# Altium schematic sheet FPGAPower.SchDoc
size A
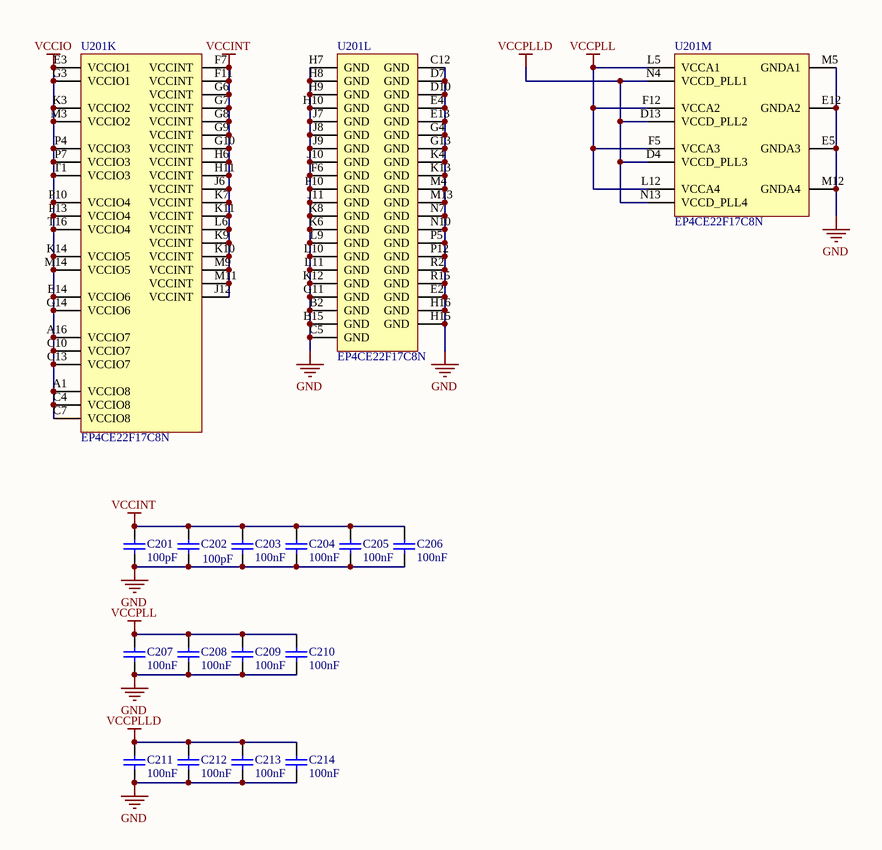
[diagram p0: FPGAPower.SchDoc]

## Parts
C201  value 100pF  [0402C]  (hidden comment: MLCC)
C202  value 100pF  [0402C]  (hidden comment: MLCC)
C203  value 100nF  [0402C]  (hidden comment: MLCC)
C204  value 100nF  [0402C]  (hidden comment: MLCC)
C205  value 100nF  [0603C]  (hidden comment: MLCC)
C206  value 100nF  [0603C]  (hidden comment: MLCC)
C207  value 100nF  [0402C]  (hidden comment: MLCC)
C208  value 100nF  [0402C]  (hidden comment: MLCC)
C209  value 100nF  [0402C]  (hidden comment: MLCC)
C210  value 100nF  [0402C]  (hidden comment: MLCC)
C211  value 100nF  [0402C]  (hidden comment: MLCC)
C212  value 100nF  [0402C]  (hidden comment: MLCC)
C213  value 100nF  [0402C]  (hidden comment: MLCC)
C214  value 100nF  [0402C]  (hidden comment: MLCC)
U201  EP4CE22F17C8N  [FBGA256_A-155]  (parts K,L,M of 13)

## Nets
GND: C201.1 C202.1 C203.1 C204.1 C205.1 C206.1 C207.1 C208.1 C209.1 C210.1 C211.1 C212.1 C213.1 C214.1 U201.B2(GND) U201.B15(GND) U201.C5(GND) U201.C12(GND) U201.D7(GND) U201.D10(GND) U201.E2(GND) U201.E4(GND) U201.E5(GNDA3) U201.E12(GNDA2) U201.E13(GND) U201.F6(GND) U201.F10(GND) U201.G4(GND) U201.G11(GND) U201.G13(GND) U201.H7(GND) U201.H8(GND) U201.H9(GND) U201.H10(GND) U201.H15(GND) U201.H16(GND) U201.J7(GND) U201.J8(GND) U201.J9(GND) U201.J10(GND) U201.J11(GND) U201.K4(GND) U201.K6(GND) U201.K8(GND) U201.K12(GND) U201.K13(GND) U201.L9(GND) U201.L10(GND) U201.L11(GND) U201.M4(GND) U201.M5(GNDA1) U201.M12(GNDA4) U201.M13(GND) U201.N7(GND) U201.N10(GND) U201.P5(GND) U201.P12(GND) U201.R2(GND) U201.R15(GND)
VCCINT: C201.2 C202.2 C203.2 C204.2 C205.2 C206.2 U201.F7(VCCINT) U201.F11(VCCINT) U201.G6(VCCINT) U201.G7(VCCINT) U201.G8(VCCINT) U201.G9(VCCINT) U201.G10(VCCINT) U201.H6(VCCINT) U201.H11(VCCINT) U201.J6(VCCINT) U201.J12(VCCINT) U201.K7(VCCINT) U201.K9(VCCINT) U201.K10(VCCINT) U201.K11(VCCINT) U201.L6(VCCINT) U201.M9(VCCINT) U201.M11(VCCINT)
VCCIO: U201.A1(VCCIO8) U201.A16(VCCIO7) U201.C4(VCCIO8) U201.C7(VCCIO8) U201.C10(VCCIO7) U201.C13(VCCIO7) U201.E3(VCCIO1) U201.E14(VCCIO6) U201.G3(VCCIO1) U201.G14(VCCIO6) U201.K3(VCCIO2) U201.K14(VCCIO5) U201.M3(VCCIO2) U201.M14(VCCIO5) U201.P4(VCCIO3) U201.P7(VCCIO3) U201.P10(VCCIO4) U201.P13(VCCIO4) U201.T1(VCCIO3) U201.T16(VCCIO4)
VCCPLL: C207.2 C208.2 C209.2 C210.2 U201.F5(VCCA3) U201.F12(VCCA2) U201.L5(VCCA1) U201.L12(VCCA4)
VCCPLLD: C211.2 C212.2 C213.2 C214.2 U201.D4(VCCD_PLL3) U201.D13(VCCD_PLL2) U201.N4(VCCD_PLL1) U201.N13(VCCD_PLL4)

## Library data of the parts
U201 = EP4CE22F17C8N: Cyclone IV Family FPGA, 1.2V Core, 153 I/O Pins, 4 PLLs, 256-Pin FBGA, Speed Grade 8, Commercial Grade, Pb-Free; Manufacturer: Altera; DatasheetVersion: ver1.6, Nov-2011; PackageVersion: ver2.0, Nov-2011; PackageReference: FBGA256_A-155; PackageDescription: 256-Pin FineLine Ball-Grid Array (FBGA) - Thin - Wire Bond - A:1.55; Code_JEDEC: MO-192-DAF-1; ComponentLink1Description: Manufacturer URL; ComponentLink1URL: http://www.altera.com/; ComponentLink2Description: Handbook; ComponentLink2URL: http://www.altera.com/literature/hb/cyclone-iv/cyclone4-handbook.pdf; ComponentLink3Description: Pinout; ComponentLink3URL: http://www.altera.com/literature/lit-dp.jsp?category=cyc%204&showspreadsheet=y; ComponentLink4Description: Package Specification; ComponentLink4URL: http://www.altera.com/devicepackaging/04R00230-03.pdf